# EAGLE design Power_MCx000 (EAGLE 5.10)
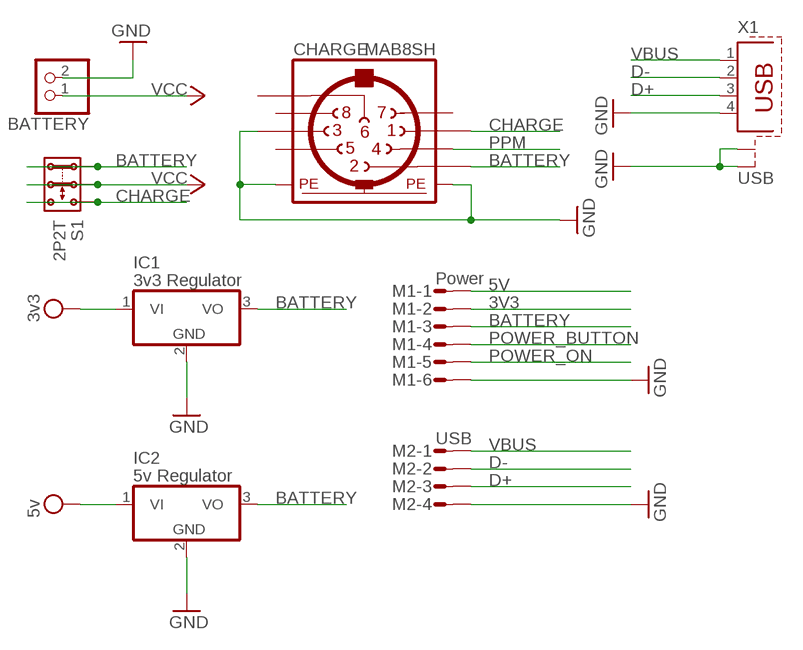
[diagram p0: schematic, sheet 1]

## Parts
BATTERY  PINHD-1X2  [1X02]
CHARGE  MAB8SH  [MAB8SH]
IC1  3v3 Regulator  7805T  [TO220H]
IC2  5v Regulator  7805T  [TO220H]
M1  Power  MICROMATCH-6  [MICROMATCH-6]
M2  USB  MICROMATCH-4  [MICROMATCH-4]
S1  2P2T  [2P2T]
X1  USB  PN61729-S  [PN61729-S]

## Nets
3V3: IC1.1(VI) M1.2 ; supply symbol labelled 3v3
5V: IC2.1(VI) M1.1 ; supply symbol labelled 5v
BATTERY: CHARGE.2 IC1.3(VO) IC2.3(VO) M1.3 S1.1.1 S1.1.2
CHARGE: CHARGE.1 S1.3.1 S1.3.2
D+: M2.3 X1.3
D-: M2.2 X1.2
GND: BATTERY.2 CHARGE.3 CHARGE.PE CHARGE.PE@(PE) IC1.2(GND) IC2.2(GND) M1.6 M2.4 X1.4 X1.S1 X1.S2
POWER_BUTTON: M1.4
POWER_ON: M1.5
PPM: CHARGE.4
VBUS: M2.1 X1.1
VCC: BATTERY.1 S1.2.1 S1.2.2
Unconnected: CHARGE.5 CHARGE.6 CHARGE.7 CHARGE.8

## Library data of the parts
BATTERY = pinhead:PINHD-1X2: PIN HEADER
CHARGE = con-hirschmann:MAB8SH: Female CONNECTOR 8 pins with shield, horizontal (DIN 41524)
IC1 IC2 = linear:78*: Positive VOLTAGE REGULATOR Source: http://cache.national.com/ds/LM/LM78L05.pdf http://www.fairchildsemi.com/ds/LM/LM7805.pdf
M1 = con-amp-micromatch:MICROMATCH-6: MicroMaTch 6 7-215464-6 / 0-215464-6 Drawing Number C-215464 DDEController.pdf
M2 = con-amp-micromatch:MICROMATCH-4: MicroMaTch 4 7-215464-4 / 0-215464-4 Drawing Number C-215464 DDEController.pdf
S1 = switch:2P2T: SLIDE SWITCH 2P2T Part No. SS-22F05-G(A)4 Source: CANAL ELECTRONIC CO., LTD .. switsch.pdf
X1 = con-berg:PN61729-S: BERG USB connector

## Board
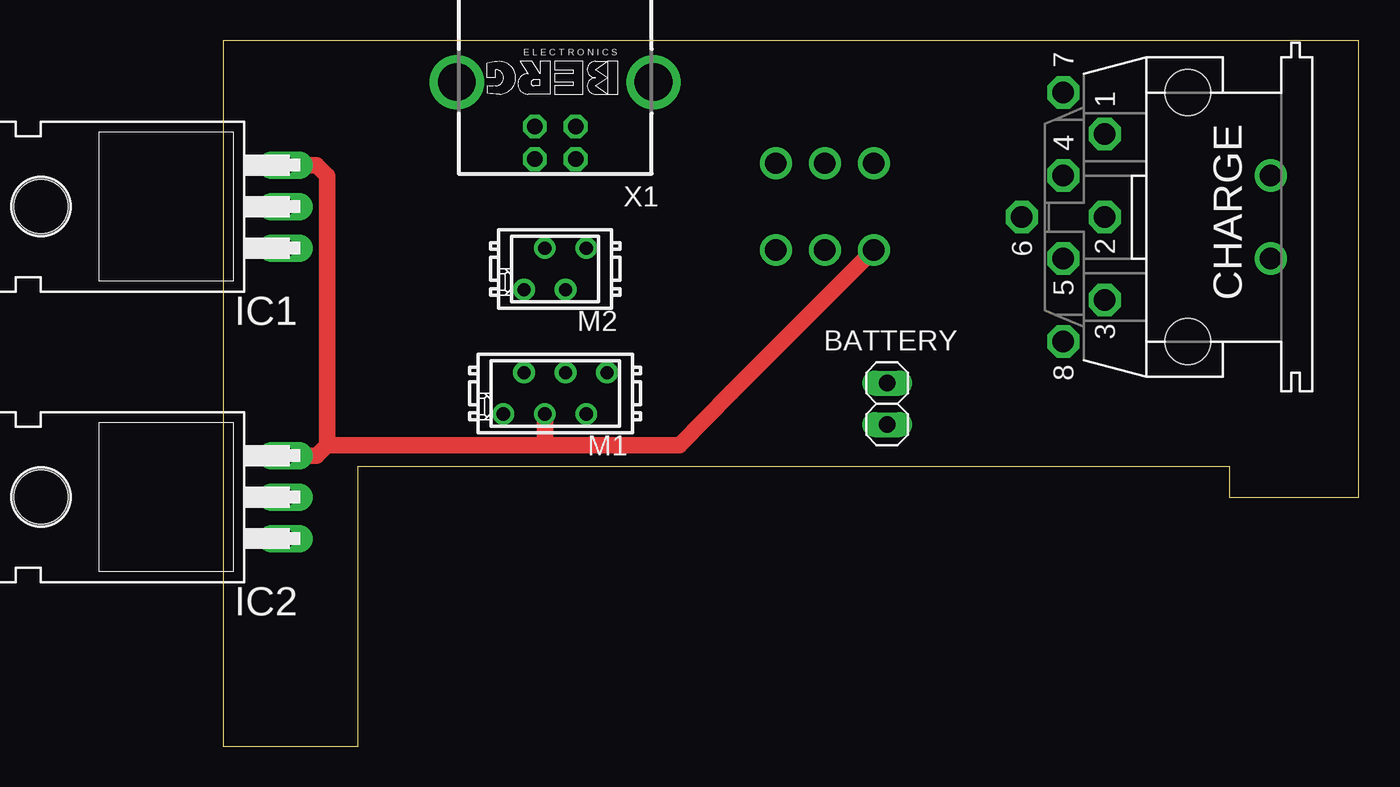
[diagram p1: board, top side]
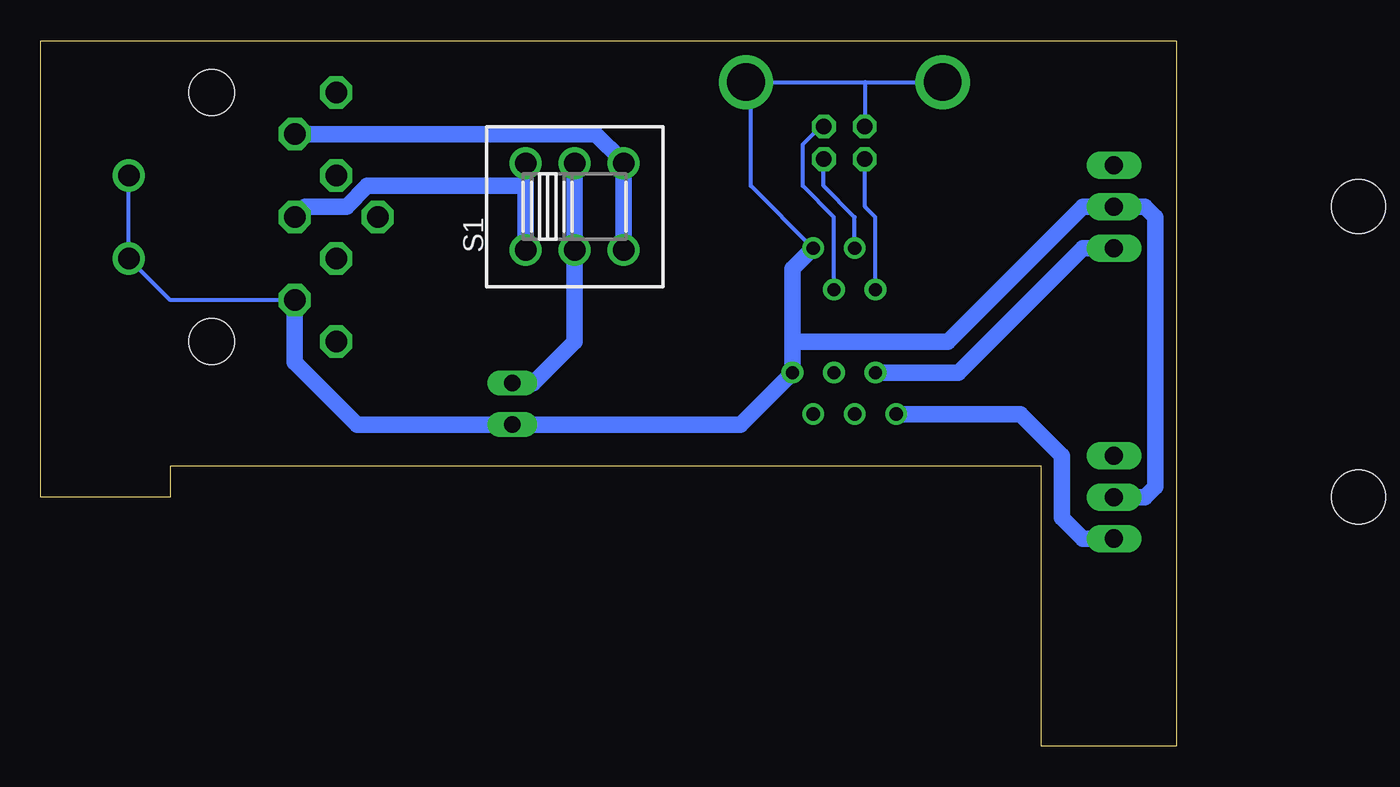
[diagram p2: board, bottom side, seen from below]

Size 69.52 x 43.17 mm. Coordinates in mm from the lower left corner, seen from the top.
Outline: 0,0 8.26,0 8.26,17.14 61.59,17.14 61.59,15.24 69.52,15.24 69.52,43.17 0,43.17 0,0
Copper layers (1*16): Top 0.035mm / dielectric 1.5mm / Bottom 0.035mm
Design rules "default *": minimum track width 10mil, minimum drill 24mil, track to track 8mil, track to pad 8mil, pad to pad 8mil, via to via 8mil, smd to smd 8mil, copper to edge 20mil, drill to drill 8mil, minimum pad ring 10mil, minimum via ring 8mil, stop-mask expansion 4mil, vias tented up to drill 0mil, thermal gap 10mil

### Footprints (pad centres in the part's own frame; a part is rotated, then mirrored left to right if it is on the bottom)
1X02 = drill 1.016 long: 1 -1.27,0; 2 1.27,0
MAB8SH = drill 1.321 octagon: 1 5.08,5.08; 2 0,5.08; 3 -5.08,5.08; 4 2.54,7.62; 5 -2.54,7.62; 6 0,10.16; 7 7.62,7.62; 8 -7.62,7.62 | drill 1.321 round: PE -2.54,-5.08; PE@ 2.54,-5.08 | hole 2.794: -7.62,0; 7.62,0
TO220H = drill 1.118 long: 1 -2.54,-10.16; 2 0,-10.16; 3 2.54,-10.16 | hole 3.302: 0,4.826
MICROMATCH-6 = drill 0.813 round: 1 3.175,1.27; 2 1.905,-1.27; 3 0.635,1.27; 4 -0.635,-1.27; 5 -1.905,1.27; 6 -3.175,-1.27
MICROMATCH-4 = drill 0.813 round: 1 1.905,1.27; 2 0.635,-1.27; 3 -0.635,1.27; 4 -1.905,-1.27
2P2T = drill 1.3 pad 1.93 round: 1.1 -3,2.65; 1.2 -3,-2.65; 2.1 0,2.65; 2.2 0,-2.65; 3.1 3,2.65; 3.2 3,-2.65
PN61729-S = drill 0.95 octagon: 1 1.25,4.71; 2 -1.25,4.71; 3 -1.25,2.71; 4 1.25,2.71 | drill 2.3 pad 2.9 round: S1 -6.02,0; S2 6.02,0

### Placement (x,y rotation side)
BATTERY  40.64,20.95 270 top
CHARGE  59.05,32.38 90 top
IC1  -6.35,33.02 90 top
IC2  -6.35,15.24 90 top
M1  20.32,21.59 180 top
M2  20.32,29.21 180 top
S1  36.83,33.02 0 bottom
X1  20.32,40.64 180 top

### Tracks (layer width: path | path; a pad name or v marks a point on that pad's centre or on a via)
3V3
  Bottom 1.016: IC1.1 5.71,30.48 13.34,22.86 M1.2
5V
  Bottom 1.016: IC2.1 5.71,12.7 6.99,13.97 6.99,17.78 9.53,20.32 M1.1
BATTERY
  Top 1.016: IC1.3 5.71,35.56 6.35,34.92 6.35,18.41 | 6.35,18.41 19.68,18.41 | IC2.3 5.71,17.78 6.35,18.41 | 19.68,18.41 M1.3 | 19.68,18.41 27.94,18.41 31.11,21.66 S1.1.2
  Bottom 1.016: CHARGE.2 53.34,33.02 50.8,33.02 49.53,34.29 39.83,34.29 | S1.1.2 39.83,34.29 | 39.83,34.29 S1.1.1
CHARGE
  Bottom 0.254: S1.3.1 34.29,35.56 33.97,35.88
  Bottom 1.016: CHARGE.1 35.56,37.47 33.97,35.88 33.83,35.73 | S1.3.2 S1.3.1
D+
  Bottom 0.254: M2.3 20.95,32.38 22.86,34.29 22.86,36.83 21.59,38.1 X1.3
D-
  Bottom 0.254: M2.2 19.68,32.38 21.59,34.29 21.59,35.93 X1.2
GND
  Bottom 0.254: CHARGE.3 61.59,27.3 CHARGE.PE CHARGE.PE@ | 19.05,40.64 19.05,38.1 X1.4 | 19.05,40.64 X1.S2 | 26.04,40.64 X1.S1 | 26.04,40.64 19.05,40.64 | 26.04,40.64 26.04,34.29 M2.4
  Bottom 1.016: IC2.2 1.91,15.24 1.27,15.88 1.27,32.38 1.91,33.02 IC1.2 5.71,33.02 13.97,24.77 23.5,24.77 | 23.5,24.77 M1.6 26.67,19.68 BATTERY.2 50.16,19.68 53.98,23.5 CHARGE.3 | 23.5,24.77 23.5,29.21 M2.4
VBUS
  Bottom 0.254: M2.1 18.41,32.38 19.05,33.02 19.05,35.93 X1.1
VCC
  Bottom 1.016: S1.2.1 S1.2.2 36.83,24.77 39.37,22.23 BATTERY.1